# EAGLE design MidiKeys_Right-SCH (EAGLE 9.0.1)
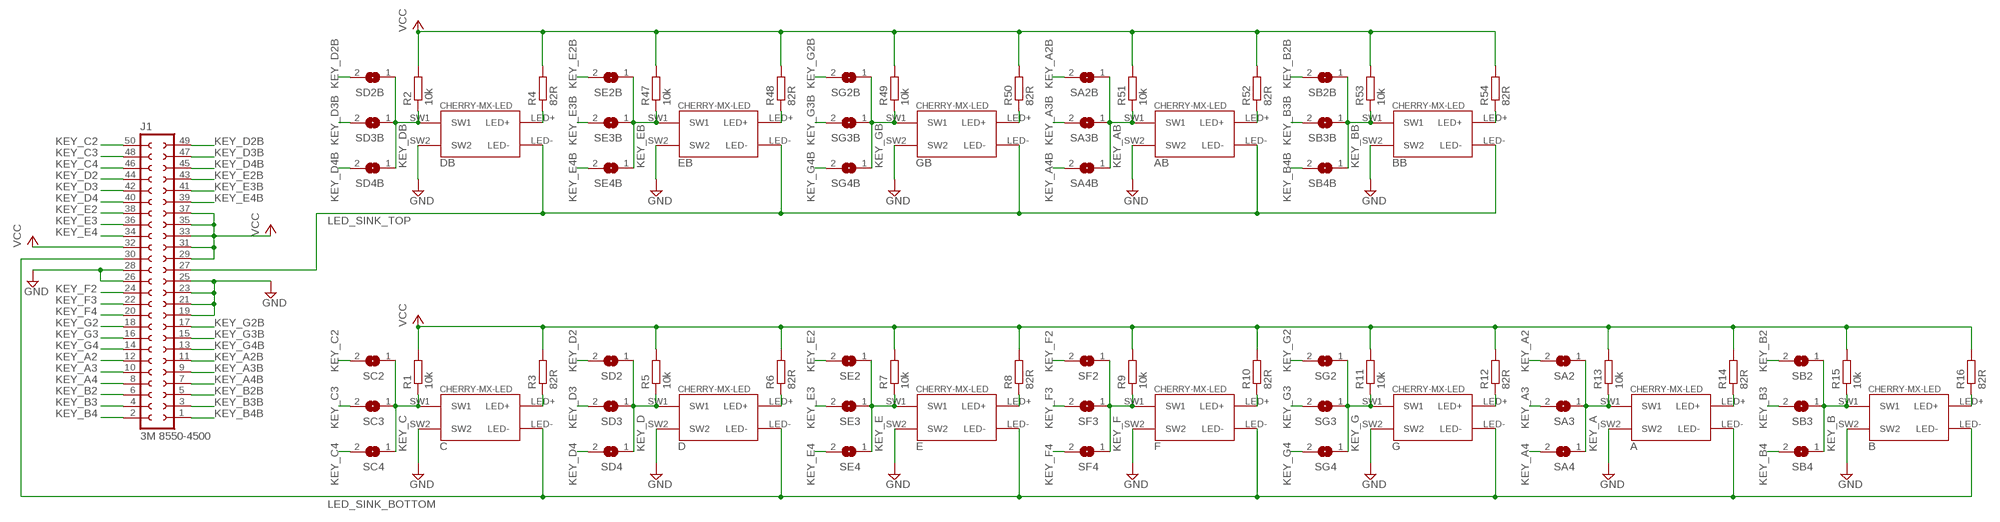
[diagram p0: schematic, sheet 1]

## Parts
A  CHERRY-MX-LED  [CHERRY-MX-LED]
AB  CHERRY-MX-LED  [CHERRY-MX-LED]
B  CHERRY-MX-LED  [CHERRY-MX-LED]
BB  CHERRY-MX-LED  [CHERRY-MX-LED]
C  CHERRY-MX-LED  [CHERRY-MX-LED]
D  CHERRY-MX-LED  [CHERRY-MX-LED]
DB  CHERRY-MX-LED  [CHERRY-MX-LED]
E  CHERRY-MX-LED  [CHERRY-MX-LED]
EB  CHERRY-MX-LED  [CHERRY-MX-LED]
F  CHERRY-MX-LED  [CHERRY-MX-LED]
G  CHERRY-MX-LED  [CHERRY-MX-LED]
GB  CHERRY-MX-LED  [CHERRY-MX-LED]
J1  3M 8550-4500  SOCKET-50V  [S50V]
R1  10k  R-EU_R0603  [R0603]
R2  10k  R-EU_R0603  [R0603]
R3  82R  R-EU_R0603  [R0603]
R4  82R  R-EU_R0603  [R0603]
R5  10k  R-EU_R0603  [R0603]
R6  82R  R-EU_R0603  [R0603]
R7  10k  R-EU_R0603  [R0603]
R8  82R  R-EU_R0603  [R0603]
R9  10k  R-EU_R0603  [R0603]
R10  82R  R-EU_R0603  [R0603]
R11  10k  R-EU_R0603  [R0603]
R12  82R  R-EU_R0603  [R0603]
R13  10k  R-EU_R0603  [R0603]
R14  82R  R-EU_R0603  [R0603]
R15  10k  R-EU_R0603  [R0603]
R16  82R  R-EU_R0603  [R0603]
R47  10k  R-EU_R0603  [R0603]
R48  82R  R-EU_R0603  [R0603]
R49  10k  R-EU_R0603  [R0603]
R50  82R  R-EU_R0603  [R0603]
R51  10k  R-EU_R0603  [R0603]
R52  82R  R-EU_R0603  [R0603]
R53  10k  R-EU_R0603  [R0603]
R54  82R  R-EU_R0603  [R0603]
SA2  SJ  [SJ]
SA2B  SJ  [SJ]
SA3  SJ  [SJ]
SA3B  SJ  [SJ]
SA4  SJ  [SJ]
SA4B  SJ  [SJ]
SB2  SJ  [SJ]
SB2B  SJ  [SJ]
SB3  SJ  [SJ]
SB3B  SJ  [SJ]
SB4  SJ  [SJ]
SB4B  SJ  [SJ]
SC2  SJ  [SJ]
SC3  SJ  [SJ]
SC4  SJ  [SJ]
SD2  SJ  [SJ]
SD2B  SJ  [SJ]
SD3  SJ  [SJ]
SD3B  SJ  [SJ]
SD4  SJ  [SJ]
SD4B  SJ  [SJ]
SE2  SJ  [SJ]
SE2B  SJ  [SJ]
SE3  SJ  [SJ]
SE3B  SJ  [SJ]
SE4  SJ  [SJ]
SE4B  SJ  [SJ]
SF2  SJ  [SJ]
SF3  SJ  [SJ]
SF4  SJ  [SJ]
SG2  SJ  [SJ]
SG2B  SJ  [SJ]
SG3  SJ  [SJ]
SG3B  SJ  [SJ]
SG4  SJ  [SJ]
SG4B  SJ  [SJ]

## Nets
GND: A.SW2 AB.SW2 B.SW2 BB.SW2 C.SW2 D.SW2 DB.SW2 E.SW2 EB.SW2 F.SW2 G.SW2 GB.SW2 J1.19 J1.21 J1.23 J1.25 J1.26 J1.28
KEY_A: A.SW1 R13.1 SA2.1 SA3.1 SA4.1
KEY_A2: J1.12 SA2.2
KEY_A2B: J1.11 SA2B.2
KEY_A3: J1.10 SA3.2
KEY_A3B: J1.9 SA3B.2
KEY_A4: J1.8 SA4.2
KEY_A4B: J1.7 SA4B.2
KEY_AB: AB.SW1 R51.1 SA2B.1 SA3B.1 SA4B.1
KEY_B: B.SW1 R15.1 SB2.1 SB3.1 SB4.1
KEY_B2: J1.6 SB2.2
KEY_B2B: J1.5 SB2B.2
KEY_B3: J1.4 SB3.2
KEY_B3B: J1.3 SB3B.2
KEY_B4: J1.2 SB4.2
KEY_B4B: J1.1 SB4B.2
KEY_BB: BB.SW1 R53.1 SB2B.1 SB3B.1 SB4B.1
KEY_C: C.SW1 R1.1 SC2.1 SC3.1 SC4.1
KEY_C2: J1.50 SC2.2
KEY_C3: J1.48 SC3.2
KEY_C4: J1.46 SC4.2
KEY_D: D.SW1 R5.1 SD2.1 SD3.1 SD4.1
KEY_D2: J1.44 SD2.2
KEY_D2B: J1.49 SD2B.2
KEY_D3: J1.42 SD3.2
KEY_D3B: J1.47 SD3B.2
KEY_D4: J1.40 SD4.2
KEY_D4B: J1.45 SD4B.2
KEY_DB: DB.SW1 R2.1 SD2B.1 SD3B.1 SD4B.1
KEY_E: E.SW1 R7.1 SE2.1 SE3.1 SE4.1
KEY_E2: J1.38 SE2.2
KEY_E2B: J1.43 SE2B.2
KEY_E3: J1.36 SE3.2
KEY_E3B: J1.41 SE3B.2
KEY_E4: J1.34 SE4.2
KEY_E4B: J1.39 SE4B.2
KEY_EB: EB.SW1 R47.1 SE2B.1 SE3B.1 SE4B.1
KEY_F: F.SW1 R9.1 SF2.1 SF3.1 SF4.1
KEY_F2: J1.24 SF2.2
KEY_F3: J1.22 SF3.2
KEY_F4: J1.20 SF4.2
KEY_G: G.SW1 R11.1 SG2.1 SG3.1 SG4.1
KEY_G2: J1.18 SG2.2
KEY_G2B: J1.17 SG2B.2
KEY_G3: J1.16 SG3.2
KEY_G3B: J1.15 SG3B.2
KEY_G4: J1.14 SG4.2
KEY_G4B: J1.13 SG4B.2
KEY_GB: GB.SW1 R49.1 SG2B.1 SG3B.1 SG4B.1
LED_SINK_BOTTOM: A.LED- B.LED- C.LED- D.LED- E.LED- F.LED- G.LED- J1.30
LED_SINK_TOP: AB.LED- BB.LED- DB.LED- EB.LED- GB.LED- J1.27
N$1: D.LED+ R6.1
N$2: E.LED+ R8.1
N$3: F.LED+ R10.1
N$4: DB.LED+ R4.1
N$5: C.LED+ R3.1
N$6: G.LED+ R12.1
N$7: A.LED+ R14.1
N$8: B.LED+ R16.1
N$24: EB.LED+ R48.1
N$25: GB.LED+ R50.1
N$26: AB.LED+ R52.1
N$27: BB.LED+ R54.1
VCC: J1.29 J1.31 J1.32 J1.33 J1.35 J1.37 R1.2 R2.2 R3.2 R4.2 R5.2 R6.2 R7.2 R8.2 R9.2 R10.2 R11.2 R12.2 R13.2 R14.2 R15.2 R16.2 R47.2 R48.2 R49.2 R50.2 R51.2 R52.2 R53.2 R54.2

## Library data of the parts
A AB B BB C D DB E EB F G GB = cherrymx:CHERRY-MX-LED: Cherry MX series keyswitch with LED
J1 = con-3m-skt-header:SOCKET-50: 50 pin PCB Socket (3m 85xx/51xx)
R1-R16 R47-R54 = resistor:R-EU_: RESISTOR, European symbol
SA2 SA2B SA3 SA3B SA4 SA4B SB2 SB2B SB3 SB3B SB4 SB4B SC2-SC4 SD2 SD2B SD3 SD3B SD4 SD4B SE2 SE2B SE3 SE3B SE4 SE4B SF2-SF4 SG2 SG2B SG3 SG3B SG4 SG4B = jumper:SJ: SMD solder JUMPER

## Board
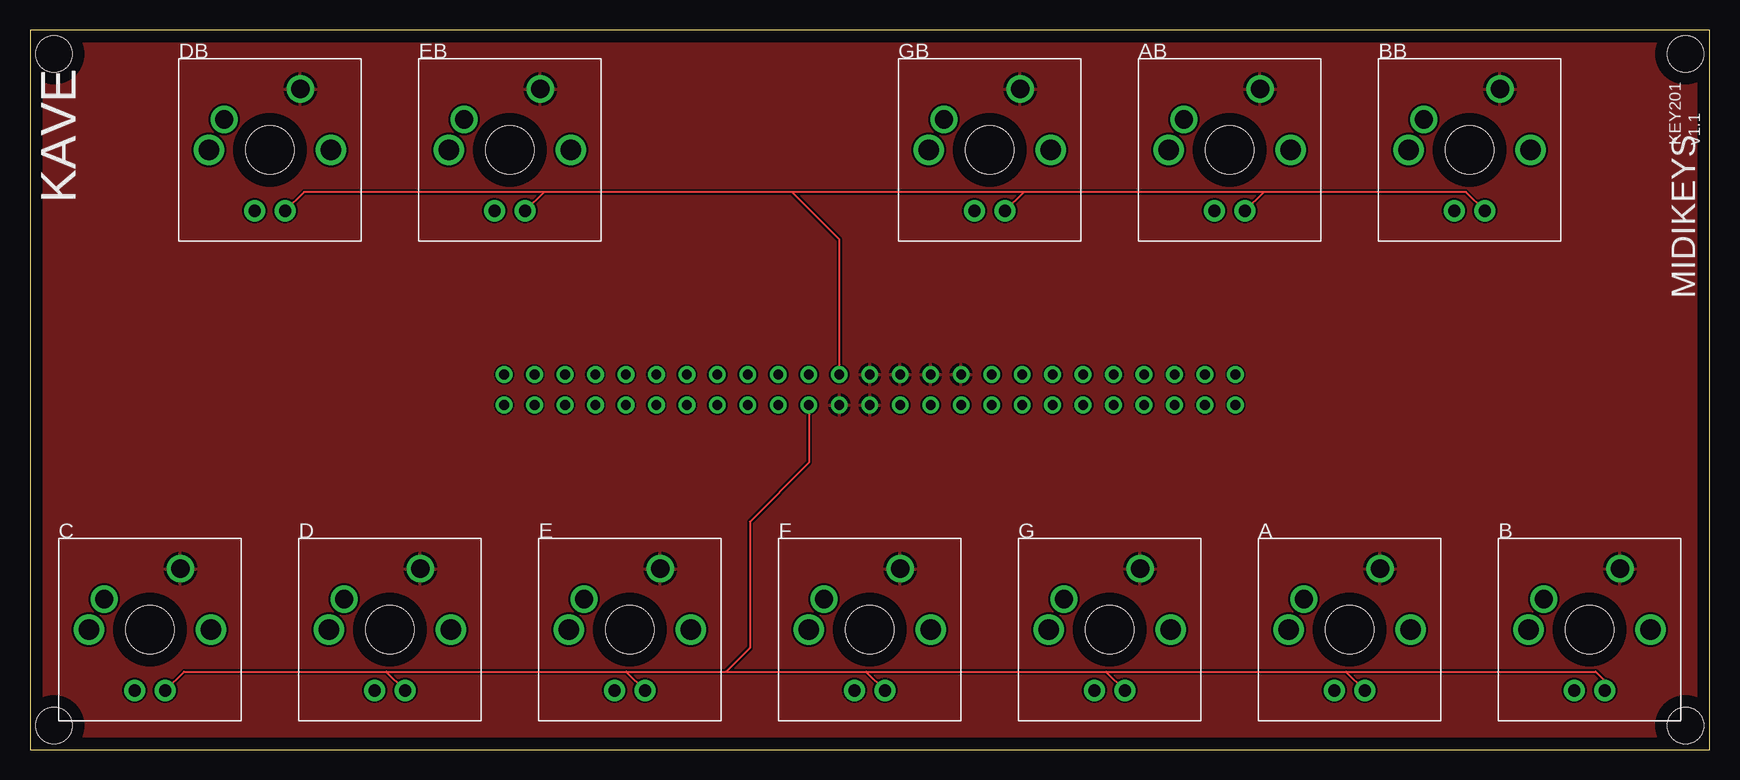
[diagram p1: board, top side]
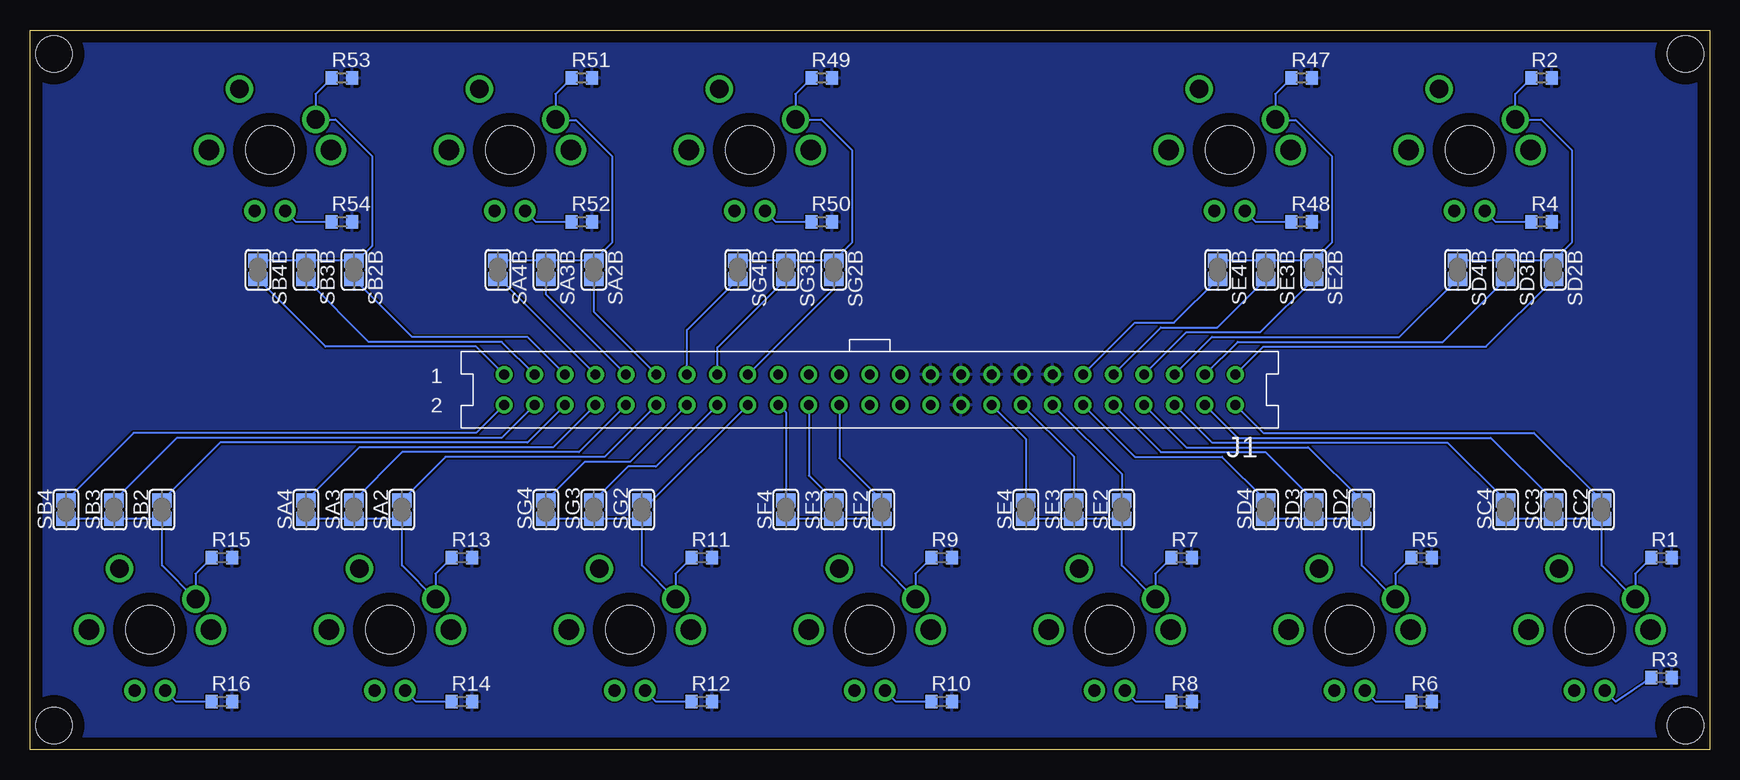
[diagram p2: board, bottom side, seen from below]

Size 140 x 60 mm. Coordinates in mm from the lower left corner, seen from the top.
Outline: 0,0 140,0 140,60 0,60 0,0
Copper layers (1*16): Top 0.035mm / dielectric 1.5mm / Bottom 0.035mm
Design rules "default": minimum track width 6mil, minimum drill 0.35mm, track to track 6mil, track to pad 6mil, pad to pad 6mil, via to via 6mil, smd to smd 6mil, copper to edge 40mil, drill to drill 6mil, minimum pad ring 10mil, minimum via ring 8mil, stop-mask expansion 4mil, vias tented up to drill 0mil, thermal gap 10mil
Holes 3 mm at 2,58 2,2 138,2 138,58

### Footprints (pad centres in the part's own frame; a part is rotated, then mirrored left to right if it is on the bottom)
CHERRY-MX-LED = drill 1.016 pad 1.778: LED+ -1.27,-5.08; LED- 1.27,-5.08 | drill 1.714 pad 1.93: P$3 -5.08,0; P$4 5.08,0 | drill 1.524 pad 2.286: SW1 -3.81,2.54; SW2 2.54,5.08 | hole 4.064: 0,0
S50V = drill 0.8 pad 1.4: 1 30.48,-1.27; 2 30.48,1.27; 3 27.94,-1.27; 4 27.94,1.27; 5 25.4,-1.27; 6 25.4,1.27; 7 22.86,-1.27; 8 22.86,1.27; 9 20.32,-1.27; 10 20.32,1.27; 11 17.78,-1.27; 12 17.78,1.27; 13 15.24,-1.27; 14 15.24,1.27; 15 12.7,-1.27; 16 12.7,1.27; 17 10.16,-1.27; 18 10.16,1.27; 19 7.62,-1.27; 20 7.62,1.27; 21 5.08,-1.27; 22 5.08,1.27; 23 2.54,-1.27; 24 2.54,1.27; 25 0,-1.27; 26 0,1.27; 27 -2.54,-1.27; 28 -2.54,1.27; 29 -5.08,-1.27; 30 -5.08,1.27; 31 -7.62,-1.27; 32 -7.62,1.27; 33 -10.16,-1.27; 34 -10.16,1.27; 35 -12.7,-1.27; 36 -12.7,1.27; 37 -15.24,-1.27; 38 -15.24,1.27; 39 -17.78,-1.27; 40 -17.78,1.27; 41 -20.32,-1.27; 42 -20.32,1.27; 43 -22.86,-1.27; 44 -22.86,1.27; 45 -25.4,-1.27; 46 -25.4,1.27; 47 -27.94,-1.27; 48 -27.94,1.27; 49 -30.48,-1.27; 50 -30.48,1.27
R0603 = smd 1 x 1.1: 1 -0.85,0; 2 0.85,0
SJ = smd 1.168 x 1.6: 1 -0.762,0; 2 0.762,0

### Placement (x,y rotation side)
A  110,10 0 top
AB  100,50 0 top
B  130,10 0 top
BB  120,50 0 top
C  10,10 0 top
D  30,10 0 top
DB  20,50 0 top
E  50,10 0 top
EB  40,50 0 top
F  70,10 0 top
G  90,10 0 top
GB  80,50 0 top
J1  70,30 180 bottom
R1  4,16 0 bottom
R2  14,56 0 bottom
R3  4,6 0 bottom
R4  14,44 0 bottom
R5  24,16 0 bottom
R6  24,4 0 bottom
R7  44,16 0 bottom
R8  44,4 0 bottom
R9  64,16 0 bottom
R10  64,4 0 bottom
R11  84,16 0 bottom
R12  84,4 0 bottom
R13  104,16 0 bottom
R14  104,4 0 bottom
R15  124,16 0 bottom
R16  124,4 0 bottom
R47  34,56 0 bottom
R48  34,44 0 bottom
R49  74,56 0 bottom
R50  74,44 0 bottom
R51  94,56 0 bottom
R52  94,44 0 bottom
R53  114,56 0 bottom
R54  114,44 0 bottom
SA2  109,20 90 bottom
SA2B  93,40 270 bottom
SA3  113,20 90 bottom
SA3B  97,40 270 bottom
SA4  117,20 90 bottom
SA4B  101,40 270 bottom
SB2  129,20 90 bottom
SB2B  113,40 270 bottom
SB3  133,20 90 bottom
SB3B  117,40 270 bottom
SB4  137,20 90 bottom
SB4B  121,40 270 bottom
SC2  9,20 90 bottom
SC3  13,20 90 bottom
SC4  17,20 90 bottom
SD2  29,20 90 bottom
SD2B  13,40 270 bottom
SD3  33,20 90 bottom
SD3B  17,40 270 bottom
SD4  37,20 90 bottom
SD4B  21,40 270 bottom
SE2  49,20 90 bottom
SE2B  33,40 270 bottom
SE3  53,20 90 bottom
SE3B  37,40 270 bottom
SE4  57,20 90 bottom
SE4B  41,40 270 bottom
SF2  69,20 90 bottom
SF3  73,20 90 bottom
SF4  77,20 90 bottom
SG2  89,20 90 bottom
SG2B  73,40 270 bottom
SG3  93,20 90 bottom
SG3B  77,40 270 bottom
SG4  97,20 90 bottom
SG4B  81,40 270 bottom

### Tracks (layer width: path | path; a pad name or v marks a point on that pad's centre or on a via)
GND
  pour Top: -1.5,62 143.5,62 143.5,-2.5 142,-4 -3.5,-4 -4,-3.5 -4,59.5
KEY_A
  Bottom 0.152: R13.1 106.19,14.66 A.SW1 109,15.35 SA2.1 SA3.1 SA4.1
KEY_A2
  Bottom 0.152: J1.12 92.11,24.4 105.36,24.4 SA2.2
KEY_A2B
  Bottom 0.152: J1.11 93,36.49 SA2B.2
KEY_A3
  Bottom 0.152: J1.10 94.25,24.8 108.96,24.8 SA3.2
KEY_A3B
  Bottom 0.152: J1.9 97,37.95 SA3B.2
KEY_A4
  Bottom 0.152: J1.8 96.39,25.2 112.56,25.2 SA4.2
KEY_A4B
  Bottom 0.152: J1.7 100.83,39.24 SA4B.2
KEY_AB
  Bottom 0.152: R51.1 96.19,54.66 AB.SW1 96.15,52.5 94.5,52.5 91.5,49.5 91.5,42.26 SA2B.1 SA3B.1 SA4B.1
KEY_B
  Bottom 0.152: R15.1 126.19,14.66 B.SW1 129,15.35 SB2.1 SB3.1 SB4.1
KEY_B2
  Bottom 0.152: J1.6 98.53,25.6 124.16,25.6 SB2.2
KEY_B2B
  Bottom 0.152: J1.5 98.53,34.4 108.16,34.4 SB2B.2
KEY_B3
  Bottom 0.152: J1.4 100.67,26 127.76,26 SB3.2
KEY_B3B
  Bottom 0.152: J1.3 100.67,34 111.76,34 SB3B.2
KEY_B4
  Bottom 0.152: J1.2 102.81,26.4 131.36,26.4 SB4.2
KEY_B4B
  Bottom 0.152: J1.1 102.81,33.6 115.36,33.6 SB4B.2
KEY_BB
  Bottom 0.152: R53.1 116.19,54.66 BB.SW1 114.54,52.54 111.5,49.5 111.5,42 112.74,40.76 SB2B.1 SB3B.1 SB4B.1
KEY_C
  Bottom 0.152: SC4.1 SC3.1 SC2.1 9,15.35 C.SW1 6.19,14.66 R1.1 5,16
KEY_C2
  Bottom 0.152: J1.50 37.19,26.4 14.64,26.4 SC2.2
KEY_C3
  Bottom 0.152: J1.48 39.33,26 18.24,26 SC3.2
KEY_C4
  Bottom 0.152: J1.46 41.47,25.6 21.84,25.6 SC4.2
KEY_D
  Bottom 0.152: R5.1 26.19,14.66 D.SW1 29,15.35 SD2.1 SD3.1 SD4.1
KEY_D2
  Bottom 0.152: J1.44 43.61,25.2 33.44,25.2 SD2.2
KEY_D2B
  Bottom 0.152: J1.49 37.19,33.6 18.64,33.6 SD2B.2
KEY_D3
  Bottom 0.152: J1.42 45.75,24.8 37.04,24.8 SD3.2
KEY_D3B
  Bottom 0.152: J1.47 39.33,34 22.24,34 SD3B.2
KEY_D4
  Bottom 0.152: J1.40 47.89,24.4 40.64,24.4 SD4.2
KEY_D4B
  Bottom 0.152: J1.45 41.47,34.4 25.84,34.4 SD4B.2
KEY_DB
  Bottom 0.152: R2.1 16.19,54.66 DB.SW1 14.04,52.54 11.5,50 11.5,42.26 SD2B.1 SD3B.1 SD4B.1
KEY_E
  Bottom 0.152: R7.1 46.19,14.66 E.SW1 49,15.35 SE2.1 SE3.1 SE4.1
KEY_E2
  Bottom 0.152: J1.38 49,22.97 SE2.2
KEY_E2B
  Bottom 0.152: J1.43 43.61,34.8 37.44,34.8 SE2B.2
KEY_E3
  Bottom 0.152: J1.36 53,24.43 SE3.2
KEY_E3B
  Bottom 0.152: J1.41 45.75,35.2 41.04,35.2 SE3B.2
KEY_E4
  Bottom 0.152: J1.34 57,25.89 SE4.2
KEY_E4B
  Bottom 0.152: J1.39 47.89,35.6 44.64,35.6 SE4B.2
KEY_EB
  Bottom 0.152: R47.1 36.19,54.66 EB.SW1 36.15,52.5 34.5,52.5 31.5,49.5 31.5,42.26 SE2B.1 SE3B.1 SE4B.1
KEY_F
  Bottom 0.152: R9.1 66.19,14.66 F.SW1 69,15.35 SF2.1 SF3.1 SF4.1
KEY_F2
  Bottom 0.152: J1.24 72.54,24.3 SF2.2
KEY_F3
  Bottom 0.152: J1.22 75.08,22.84 SF3.2
KEY_F4
  Bottom 0.152: J1.20 77,28.11 SF4.2
KEY_G
  Bottom 0.152: R11.1 86.19,14.66 G.SW1 89,15.35 SG2.1 SG3.1 SG4.1
KEY_G2
  Bottom 0.152: J1.18 88.13,20.76 SG2.2
KEY_G2B
  Bottom 0.152: J1.17 73,38.43 SG2B.2
KEY_G3
  Bottom 0.152: J1.16 87.83,23.6 90.16,23.6 SG3.2
KEY_G3B
  Bottom 0.152: J1.15 82.7,33.54 SG3B.2
KEY_G4
  Bottom 0.152: J1.14 89.97,24 93.76,24 SG4.2
KEY_G4B
  Bottom 0.152: J1.13 85.24,35 SG4B.2
KEY_GB
  Bottom 0.152: R49.1 76.19,54.66 GB.SW1 74.04,52.54 71.5,50 71.5,42.26 SG2B.1 SG3B.1 SG4B.1
LED_SINK_BOTTOM
  Top 0.152: C.LED- 12.85,6.5 29.69,6.5 | B.LED- 131.27,5.73 130.5,6.5 109.69,6.5 | 29.69,6.5 49.69,6.5 | 49.69,6.5 58,6.5 | 58,6.5 69.69,6.5 | 69.69,6.5 89.69,6.5 | 89.69,6.5 109.69,6.5 | A.LED- 109.69,6.5 | G.LED- 89.69,6.5 | F.LED- 69.69,6.5 | E.LED- 49.69,6.5 | D.LED- 29.69,6.5 | J1.30 64.92,23.92 60,19 60,8.5 58,6.5
LED_SINK_TOP
  Top 0.152: BB.LED- 119.69,46.5 102.85,46.5 | 102.85,46.5 AB.LED- | 102.85,46.5 82.85,46.5 | 82.85,46.5 GB.LED- | 82.85,46.5 63.5,46.5 | 63.5,46.5 43,46.5 42.85,46.5 | 42.85,46.5 EB.LED- | J1.27 67.46,42.54 63.5,46.5 | 42.85,46.5 22.85,46.5 DB.LED-
N$1
  Bottom 0.152: R6.1 27.81,4 D.LED+
N$2
  Bottom 0.152: R8.1 47.81,4 E.LED+
N$3
  Bottom 0.152: R10.1 67.81,4 F.LED+
N$4
  Bottom 0.152: R4.1 17.81,44 DB.LED+
N$5
  Bottom 0.152: R3.1 7.81,4 C.LED+
N$6
  Bottom 0.152: R12.1 87.81,4 G.LED+
N$7
  Bottom 0.152: R14.1 107.81,4 A.LED+
N$8
  Bottom 0.152: R16.1 127.81,4 B.LED+
N$24
  Bottom 0.152: R48.1 37.81,44 EB.LED+
N$25
  Bottom 0.152: R50.1 77.81,44 GB.LED+
N$26
  Bottom 0.152: R52.1 97.81,44 AB.LED+
N$27
  Bottom 0.152: R54.1 117.81,44 BB.LED+
VCC
  pour Bottom: -1.5,61 141,61 142,60 142,0 140,-2 -2,-2 -2.5,-1.5 -2.5,60.5 -2,61 -1.5,60.5

### Text on the board
tPlace: KEY201 | v1.1 | KAVE | MIDIKEYS